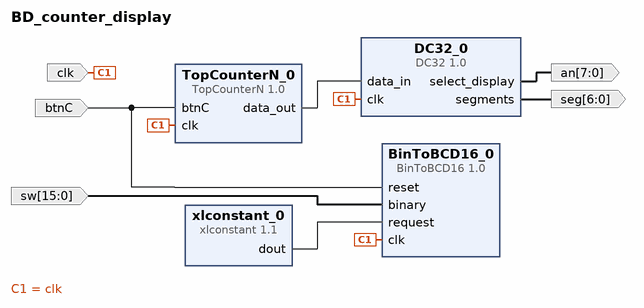
[diagram p0: block diagram of the top level]
# Vivado block design BD_counter_display, Vivado 2015.4
create_bd_design BD_counter_display

create_bd_port -dir O -from 7 -to 0 an
create_bd_port -dir O -from 6 -to 0 seg
create_bd_port -dir I clk
create_bd_port -dir I btnC
create_bd_port -dir I -from 15 -to 0 sw

create_bd_cell -type ip -vlnv ua.pt:user:DC32:1.0 DC32_0
create_bd_cell -type ip -vlnv ua.pt:user:BinToBCD16:1.0 BinToBCD16_0
create_bd_cell -type ip -vlnv xilinx.com:ip:xlconstant:1.1 xlconstant_0
create_bd_cell -type ip -vlnv ua.pt:user:TopCounterN:1.0 TopCounterN_0

# ---- connections ----

connect_bd_net [get_bd_pins DC32_0/select_display] [get_bd_ports an]
connect_bd_net [get_bd_pins DC32_0/segments] [get_bd_ports seg]
connect_bd_net [get_bd_ports clk] [get_bd_pins BinToBCD16_0/clk] [get_bd_pins DC32_0/clk] [get_bd_pins TopCounterN_0/clk]
connect_bd_net [get_bd_ports btnC] [get_bd_pins BinToBCD16_0/reset] [get_bd_pins TopCounterN_0/btnC]
connect_bd_net [get_bd_ports sw] [get_bd_pins BinToBCD16_0/binary]
connect_bd_net [get_bd_pins xlconstant_0/dout] [get_bd_pins BinToBCD16_0/request]
connect_bd_net [get_bd_pins TopCounterN_0/data_out] [get_bd_pins DC32_0/data_in]

validate_bd_design
save_bd_design
